# Altium schematic sheet KIP_2Schematic.SchDoc
size Tabloid; SheetNumber: 1; SheetTotal: 1
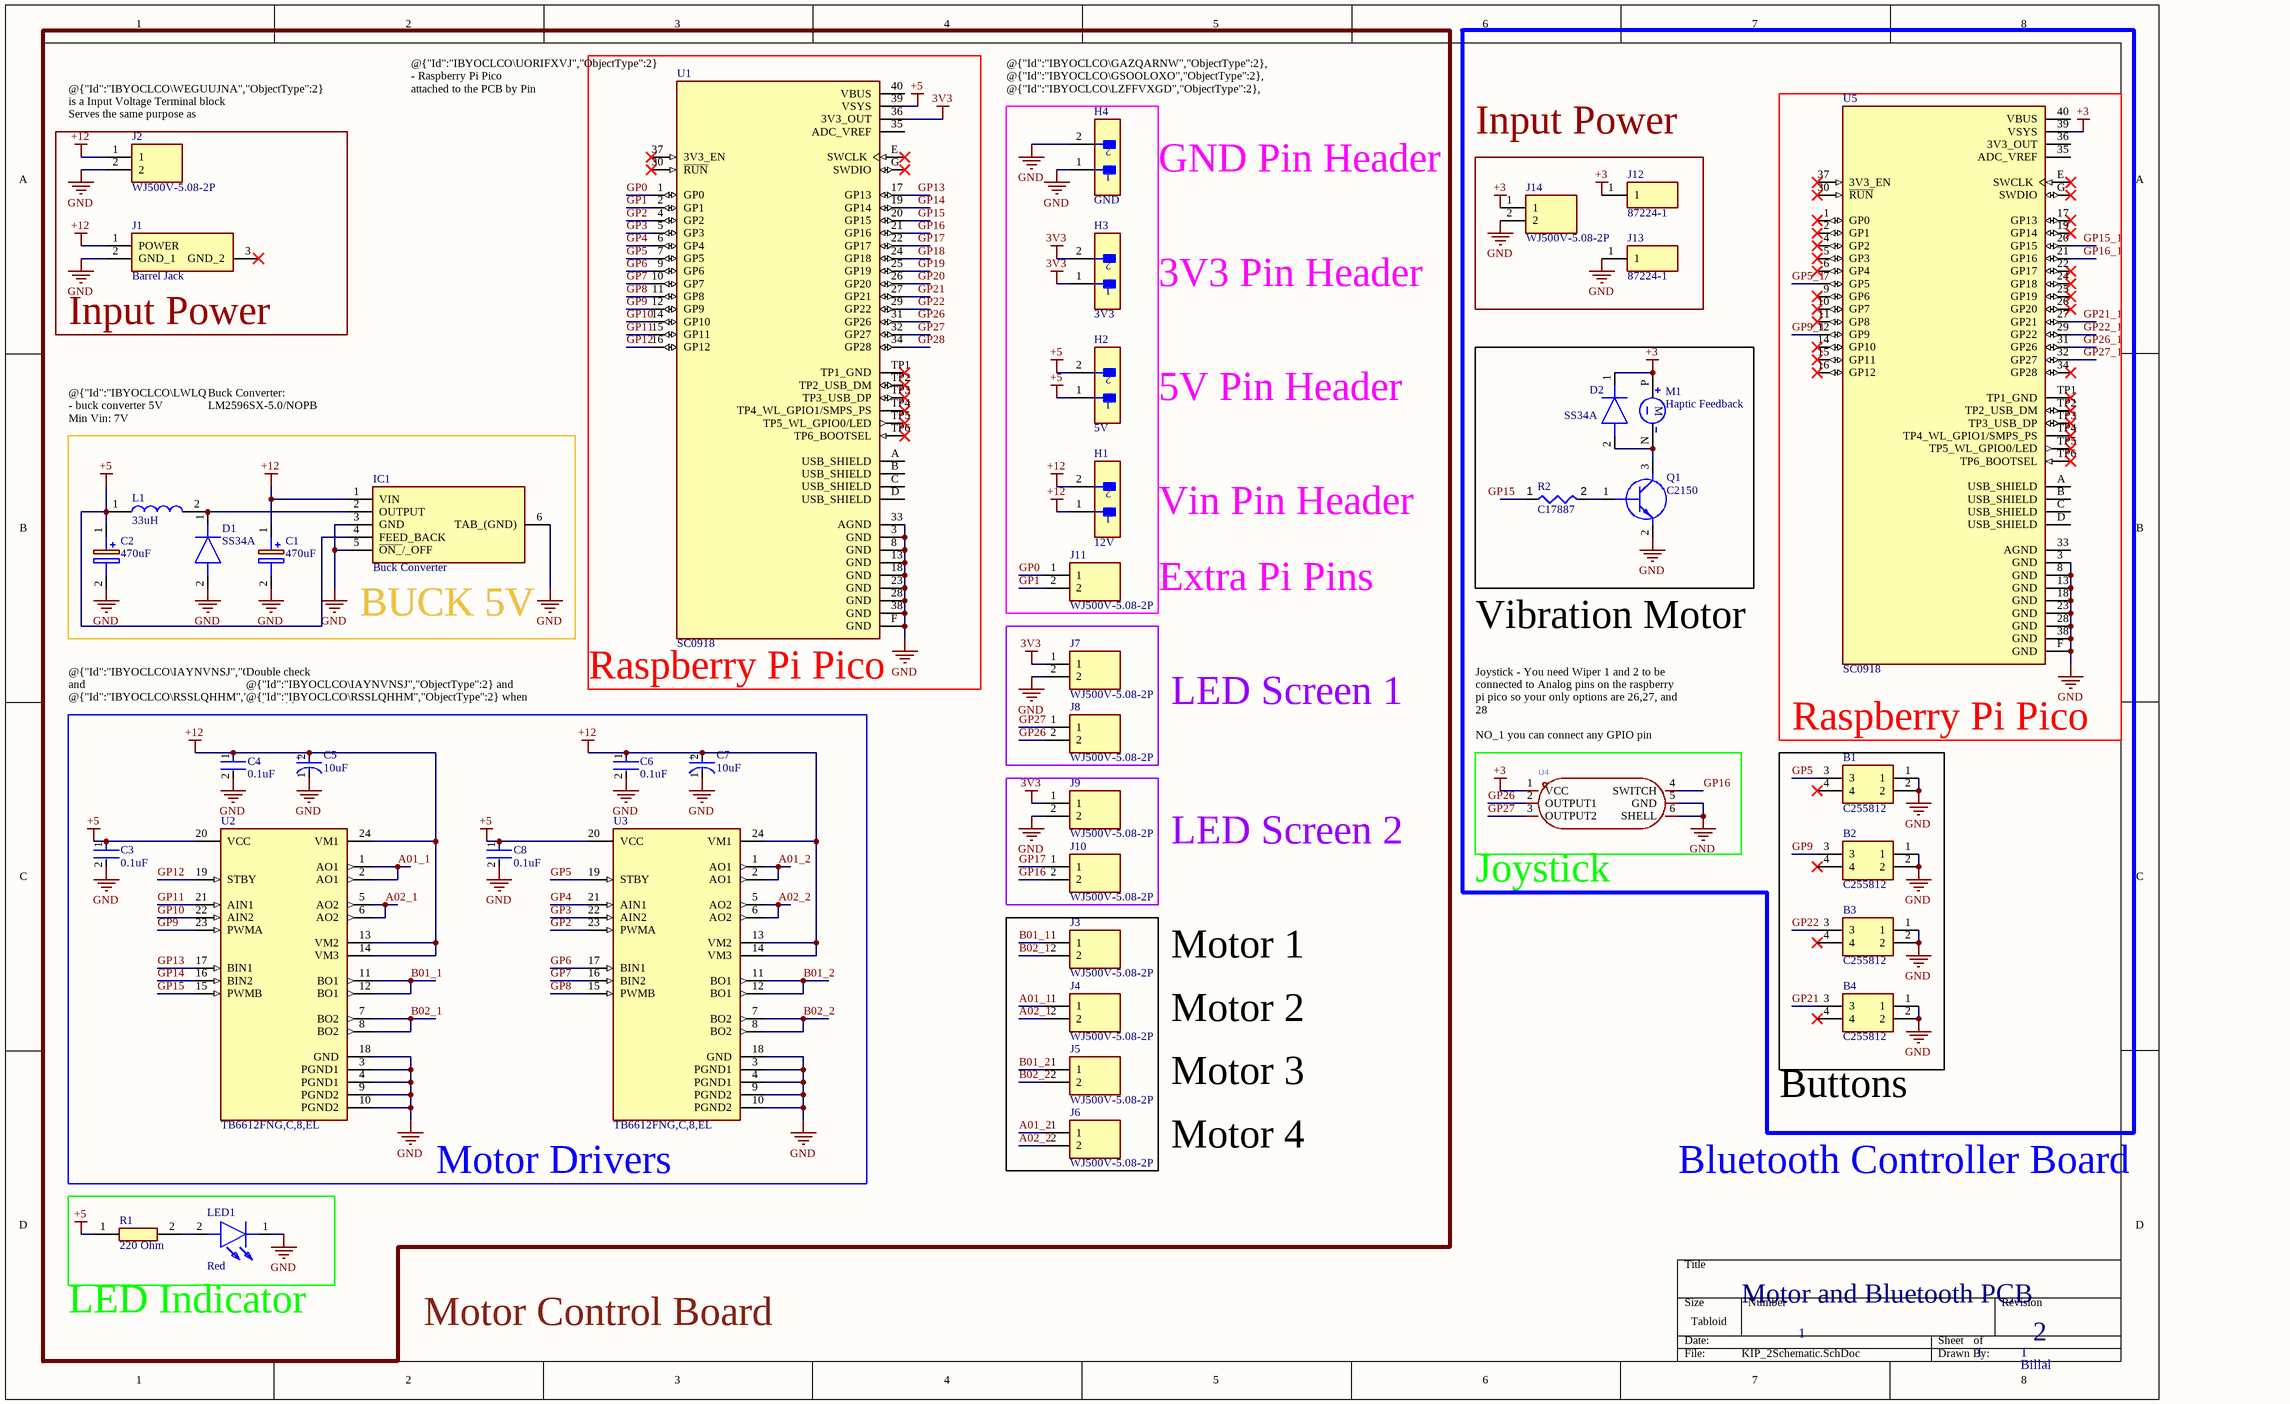
[diagram p0: KIP_2Schematic.SchDoc]

## Parts
B1  C255812  [Button]
B2  C255812  [Button]
B3  C255812  [Button]
B4  C255812  [Button]
C1  470uF  [CAPPRD350W65D800H2200]
C2  470uF  [CAPPRD350W65D800H2200]
C3  0.1uF  [FP-CL779-IPC_C]
C4  0.1uF  [FP-CL779-IPC_C]
C5  10uF  [FP-TAJA-MFG]
C6  0.1uF  [FP-CL779-IPC_C]
C7  10uF  [FP-TAJA-MFG]
C8  0.1uF  [FP-CL779-IPC_C]
D1  SS34A  [DIOM5026X262N]
D2  SS34A  [DIOM5026X262N]
H1  12V  [FP-M20-9990246-MFG]
H2  5V  [FP-M20-9990246-MFG]
H3  3V3  [FP-M20-9990246-MFG]
H4  GND  [FP-M20-9990246-MFG]
IC1  Buck Converter  [KTT0005B]
J1  Barrel Jack  [694106301002_1]
J2  WJ500V-5.08-2P  [WJ500V5082P]
J3  WJ500V-5.08-2P  [WJ500V5082P]
J4  WJ500V-5.08-2P  [WJ500V5082P]
J5  WJ500V-5.08-2P  [WJ500V5082P]
J6  WJ500V-5.08-2P  [WJ500V5082P]
J7  WJ500V-5.08-2P  [WJ500V5082P]
J8  WJ500V-5.08-2P  [WJ500V5082P]
J9  WJ500V-5.08-2P  [WJ500V5082P]
J10  WJ500V-5.08-2P  [WJ500V5082P]
J11  WJ500V-5.08-2P  [WJ500V5082P]
J12  87224-1  [HDRV1W66P0X254_1X1_213X254X1074P]
J13  87224-1  [HDRV1W66P0X254_1X1_213X254X1074P]
J14  WJ500V-5.08-2P  [WJ500V5082P]
L1  33uH  [INDPM144128X650N]
LED1  Red  [LEDC1608X70N]
M1  Haptic Feedback  [Haptic Feedback]
Q1  C2150  [SOT95P240X115-3N]
R1  220 Ohm  [RESC2013X65N]
R2  C17887  [Resistor 300Ohms]
U1  SC0918  [No pin-header Pi]
U2  TB6612FNG,C,8,EL  [FP-SSOP24-P-300-0_65A-IPC_A]
U3  TB6612FNG,C,8,EL  [FP-SSOP24-P-300-0_65A-IPC_A]
U4  C42411044  [Correct Joystick]  (value not drawn)
U5  SC0918  [No pin-header Pi]

## Blocks framed on the sheet
Raspberry Pi Pico: U1
Input Power: J1 J2
Input Power: J12-J14
BUCK 5V: C1 C2 D1 IC1 L1
Motor Drivers: C3-C8 U2 U3
Raspberry Pi Pico: B1-B4

## Nets
3V3: H3.1 H3.2 J7.1 J9.1 U1.36(3V3_OUT)
+3: D2.1(K) J12.1 J14.1 M1.P(POS) U4.1(VCC) U5.39(VSYS)
+5: C2.1(+) C3.1 C8.1 H2.1 H2.2 IC1.4(FEED_BACK) L1.1 R1.1 U1.39(VSYS) U2.20(VCC) U3.20(VCC)
+12: C1.1(+) C4.1 C5.2(A) C6.1 C7.2(A) H1.1 H1.2 IC1.1(VIN) J1.1(POWER) J2.1 U2.13(VM2) U2.14(VM3) U2.24(VM1) U3.13(VM2) U3.14(VM3) U3.24(VM1)
GND: B1.1 B1.2 B2.1 B2.2 B3.1 B3.2 B4.1 B4.2 C1.2(-) C2.2(-) C3.2 C4.2 C5.1(C) C6.2 C7.1(C) C8.2 D1.2(A) H4.1 H4.2 IC1.3(GND) IC1.5(~{ON_}/_OFF) IC1.6(TAB_(GND)) J1.2(GND_1) J2.2 J7.2 J9.2 J13.1 J14.2 LED1.1(K) Q1.2(E) U1.3(GND) U1.8(GND) U1.13(GND) U1.18(GND) U1.23(GND) U1.28(GND) U1.33(AGND) U1.38(GND) U1.F(GND) U2.3(PGND1) U2.4(PGND1) U2.9(PGND2) U2.10(PGND2) U2.18(GND) U3.3(PGND1) U3.4(PGND1) U3.9(PGND2) U3.10(PGND2) U3.18(GND) U4.5(GND) U4.6(SHELL) U5.3(GND) U5.8(GND) U5.13(GND) U5.18(GND) U5.23(GND) U5.28(GND) U5.38(GND) U5.F(GND)
A01_1: J4.1 U2.1(AO1) U2.2(AO1)
A01_2: J6.1 U3.1(AO1) U3.2(AO1)
A02_1: J4.2 U2.5(AO2) U2.6(AO2)
A02_2: J6.2 U3.5(AO2) U3.6(AO2)
B01_1: J3.1 U2.11(BO1) U2.12(BO1)
B01_2: J5.1 U3.11(BO1) U3.12(BO1)
B02_1: J3.2 U2.7(BO2) U2.8(BO2)
B02_2: J5.2 U3.7(BO2) U3.8(BO2)
GP0: J11.1 U1.1(GP0)
GP1: J11.2 U1.2(GP1)
GP2: U1.4(GP2) U3.23(PWMA)
GP3: U1.5(GP3) U3.22(AIN2)
GP4: U1.6(GP4) U3.21(AIN1)
GP5: B1.3 U1.7(GP5) U3.19(STBY)
GP5_1: U5.7(GP5)
GP6: U1.9(GP6) U3.17(BIN1)
GP7: U1.10(GP7) U3.16(BIN2)
GP8: U1.11(GP8) U3.15(PWMB)
GP9: B2.3 U1.12(GP9) U2.23(PWMA)
GP9_1: U5.12(GP9)
GP10: U1.14(GP10) U2.22(AIN2)
GP11: U1.15(GP11) U2.21(AIN1)
GP12: U1.16(GP12) U2.19(STBY)
GP13: U1.17(GP13) U2.17(BIN1)
GP14: U1.19(GP14) U2.16(BIN2)
GP15: U1.20(GP15) U2.15(PWMB)
GP15_1: U5.20(GP15)
GP16: J10.2 U1.21(GP16) U4.4(SWITCH)
GP16_1: U5.21(GP16)
GP17: J10.1 U1.22(GP17)
GP18: U1.24(GP18)
GP19: U1.25(GP19)
GP20: U1.26(GP20)
GP21: B4.3 U1.27(GP21)
GP21_1: U5.27(GP21)
GP22: B3.3 U1.29(GP22)
GP22_1: U5.29(GP22)
GP26: J8.2 U1.31(GP26) U4.2(OUTPUT1)
GP26_1: U5.31(GP26)
GP27: J8.1 U1.32(GP27) U4.3(OUTPUT2)
GP27_1: U5.32(GP27)
GP28: U1.34(GP28)
NetD1_1: D1.1(K) IC1.2(OUTPUT) L1.2
NetD2_2: D2.2(A) M1.N(NEG) Q1.3(C)
NetLED1_2: LED1.2(A) R1.2
NetQ1_1: Q1.1(B) R2.2

Not connected (* = marked no-connect by the designer): B1 4*; B2 4*; B3 4*; B4 4*; J1 3(GND_2)*; R2 1; U1 30(~{RUN})* 35(ADC_VREF) 37(3V3_EN)* 40(VBUS) A(USB_SHIELD) B(USB_SHIELD) C(USB_SHIELD) D(USB_SHIELD) E(SWCLK)* G(SWDIO)* TP1(TP1_GND)* TP2(TP2_USB_DM)* TP3(TP3_USB_DP)* TP4(TP4_WL_GPIO1/SMPS_PS)* TP5(TP5_WL_GPIO0/LED)* TP6(TP6_BOOTSEL)*; U5 1(GP0)* 2(GP1)* 4(GP2)* 5(GP3)* 6(GP4)* 9(GP6)* 10(GP7)* 11(GP8)* 14(GP10)* 15(GP11)* 16(GP12)* 17(GP13)* 19(GP14)* 22(GP17)* 24(GP18)* 25(GP19)* 26(GP20)* 30(~{RUN})* 33(AGND) 34(GP28)* 35(ADC_VREF) 36(3V3_OUT) 37(3V3_EN)* 40(VBUS) A(USB_SHIELD) B(USB_SHIELD) C(USB_SHIELD) D(USB_SHIELD) E(SWCLK)* G(SWDIO)* TP1(TP1_GND)* TP2(TP2_USB_DM)* TP3(TP3_USB_DP)* TP4(TP4_WL_GPIO1/SMPS_PS)* TP5(TP5_WL_GPIO0/LED)* TP6(TP6_BOOTSEL)*

## Notes on the sheet
- @{"Id":"IBYOCLCO\UORIFXVJ","ObjectType":2} - Raspberry Pi Pico
  attached to the PCB by Pin Headers
- @{"Id":"IBYOCLCO\GAZQARNW","ObjectType":2}, @{"Id":"IBYOCLCO\GSOOLOXO","ObjectType":2}, @{"Id":"IBYOCLCO\LZFFVXGD","ObjectType":2}, @{"Id":"IBYOCLCO\AGFTMCIK","ObjectType":2}, and @{"Id":"IBYOCLCO\RTYWPQXP","ObjectType":2} are all unnecessary
- (near J2) @{"Id":"IBYOCLCO\WEGUUJNA","ObjectType":2} is a Input Voltage Terminal block
  Serves the same purpose as @{"Id":"IBYOCLCO\JABENFYY","ObjectType":2}
- GND Pin Header
- 3V3 Pin Header
- 5V Pin Header
- @{"Id":"IBYOCLCO\LWLQUORI","ObjectType":2} - buck converter 5V
  Min Vin: 7V
  Max Vin: 15V
- Buck Converter: LM2596SX-5.0/NOPB
- Vin Pin Header
- Extra Pi Pins
- Vibration Motor
- @{"Id":"IBYOCLCO\IAYNVNSJ","ObjectType":2} and @{"Id":"IBYOCLCO\RSSLQHHM","ObjectType":2} are both copies of the same motor driver - TB6612FNG(O,C,8,EL
- Double check @{"Id":"IBYOCLCO\IAYNVNSJ","ObjectType":2} and @{"Id":"IBYOCLCO\RSSLQHHM","ObjectType":2} when placing a Assembly order on JLCPCB for some reason it rotates them by 270 degrees and check @{"Id":"IBYOCLCO\ZWIIDHKI","ObjectType":2} and @{"Id":"IBYOCLCO\QKLSIOWQ","ObjectType":2} JLCPCB rotates it by 180 degrees
- LED Screen 1
- (near U4) Joystick - You need Wiper 1 and 2 to be connected to Analog pins on the raspberry pi pico so your only options are 26,27, and 28
  NO_1 you can connect any GPIO pin
- LED Screen 2
- (near U4) Joystick
- Motor 1
- Motor 2
- Motor 3
- (near B4) Buttons
- Motor 4
- Bluetooth Controller Board
- LED Indicator
- Motor Control Board
- Motor and Bluetooth PCB
- 1
- 2
- Billal
- Labels drawn without touching a wire or pin: GP15
- (in symbol CMP-1661-00004-2) +
- (in symbol Haptic Feedback) M

## Library data of the parts
B1-B4 = 1TS005F-2500-5001: Switch; Manufacturer_Name: HYP (Hongyuan Precision); Datasheet Link: https://datasheet.lcsc.com/szlcsc/HYP-1TS005F-2500-5001_C255812.pdf; Height: 5.1mm; Manufacturer_Part_Number: 1TS005F-2500-5001
C1 C2 = EEU-FR1V471LB: C178717; Manufacturer_Name: Panasonic; Datasheet Link: http://industrial.panasonic.com/cdbs/www-data/pdf/RDF0000/ABA0000C1259.pdf; Height: 22mm; Manufacturer_Part_Number: EEU-FR1V471LB; Mouser Part Number: 667-EEU-FR1V471LB; Mouser Price/Stock: https://www.mouser.co.uk/ProductDetail/Panasonic/EEU-FR1V471LB?qs=n1SRcuzDZT29cYaqooxsEQ%3D%3D; Arrow Part Number: EEU-FR1V471LB; Arrow Price/Stock: https://www.arrow.com/en/products/eeu-fr1v471lb/panasonic?region=nac
C3 C4 C6 C8 = CMP-13271-002336-1: C307331; LCSC: C307331
C5 C7 = CMP-1661-00004-2: C7171; Voltage Rating: 16V; ESR (Equivalent Series Resistance): 3R; Leakage Current: 1.6uA; Dissipation Factor: 8%; Dielectric Material: Tantalum; Polarity: Polar; Tolerance: 10%; Length: 3.2mm; Features: General Purpose; Voltage: 16V; Mount: Surface Mount; Case/Package: 1206; Number of Pins: 2; Case Code (Metric): 3216; Radiation Hardening: No; Min Operating Temperature: -55°C; Case Code (Imperial): 1206; Height - Seated (Max): 0.071inch; Lead Free: Lead Free; Termination: SMD/SMT; Width: 1.6mm; Capacitance: 10uF; Lead Pitch: 1.1mm; Max Operating Temperature: 125°C; Voltage Rating (DC): 16V; Packaging: Tape and Reel; Package Quantity: 1; REACH SVHC: No SVHC; Depth: 1.6mm; Height: 1.6mm; LCSC: C7171
D1 D2 = SS34A: Diode; Manufacturer_Name: HY Electronic; Datasheet Link: https://datasheet.datasheetarchive.com/originals/distributors/Datasheets-3/DSA-43252.pdf; Height: 2.62mm; Manufacturer_Part_Number: SS34A
H1-H4 = CMP-15831-000009-1: C492401; Manufacturer: Harwin; Manufacturer Part Number: M20-9990246; Conn Gender: Male; Conn Orientation: Vertical; Pitch: 2.54mm; Number Of Contacts: 2; Current Rating: 3A; ComponentLink2URL: https://cdn.harwin.com/pdfs/M20-999.pdf; ComponentLink2Description: Datasheet; Package: M20-9990246; Temperature: -40°C to +105°C; Octopart: https://octopart.com/m20-9990246-harwin-2590635; Mouser Description: 2.54mm (0.1") Pitch SIL Vertical PC Tail Pin Header, 6.1mm mating pin height, tin, 2 contacts; Temperature Range High: +105°C; Device Class L1: Connectors; RoHS: TRUE; Automotive: No; Height: 8.99mm; Number Of Rows: 1; Contact Material: Tin,Nickel; Category: Conn; Lead Free: Yes; Digikey Description: CONN HEADER VERT 2POS 2.54MM; Temperature Range Low: -40°C; Device Class L3: unset; Device Class L2: Headers and Wire Housings
IC1 = LM2596SX-5.0_NOPB: C10002; Manufacturer_Name: Texas Instruments; Manufacturer_Part_Number: LM2596SX-5.0/NOPB; Datasheet Link: http://www.ti.com/lit/gpn/lm2596; Mouser Part Number: 926-LM2596SX-5.0NOPB; Mouser Price/Stock: https://www.mouser.co.uk/ProductDetail/Texas-Instruments/LM2596SX-5.0-NOPB?qs=X1J7HmVL2ZGZ5T4VcWdmNw%3D%3D; Arrow Part Number: LM2596SX-5.0/NOPB; Arrow Price/Stock: https://www.arrow.com/en/products/lm2596sx-5.0nopb/texas-instruments?utm_currency=USD&region=nac; LCSC: C10002
J1 = 694106301002: C5441017; Manufacturer_Name: Wurth Elektronik; Datasheet Link: https://datasheet.datasheetarchive.com/originals/distributors/Datasheets_SAMA/1c153bd2ba42bb51bda59ee4cd9765cd.pdf; Manufacturer_Part_Number: 694106301002; Mouser Part Number: 710-694106301002; Mouser Price/Stock: https://www.mouser.co.uk/ProductDetail/Wurth-Elektronik/694106301002?qs=a9WhcLg8qCwOEkcI62k5mA%3D%3D; LCSC: C5441017
J2-J11 J14 = WJ500V-5.08-2P: C8465; Manufacturer_Name: Ningbo Kangnex; Datasheet Link: https://datasheet.lcsc.com/szlcsc/1912251636_Ningbo-Kangnex-Elec-WJ500V-5-08-2P_C8465.pdf; Height: 14.2mm; Manufacturer_Part_Number: WJ500V-5.08-2P; LCSC: C8465
J12 J13 = 87224-1: Connector; Manufacturer_Name: TE Connectivity; Datasheet Link: https://www.te.com/commerce/DocumentDelivery/DDEController?Action=srchrtrv&DocNm=87224&DocType=Customer+Drawing&DocLang=English; Height: 10.744mm; Manufacturer_Part_Number: 87224-1; Mouser Part Number: 571-872241; Mouser Price/Stock: https://www.mouser.co.uk/ProductDetail/TE-Connectivity/87224-1?qs=uJX40y%252BSWqgHHhtbHlovpg%3D%3D; Arrow Part Number: 87224-1; Arrow Price/Stock: https://www.arrow.com/en/products/87224-1/te-connectivity?region=nac
L1 = SLO1365H330MTT: C364090; Manufacturer_Name: Sunltech Tech; Datasheet Link: https://datasheet.lcsc.com/lcsc/1912111437_Sunltech-Tech-SLO1365H330MTT_C364090.pdf; Height: 6.5mm; Manufacturer_Part_Number: SLO1365H330MTT
LED1 = KT-0603R: C2286; Manufacturer_Name: Hubei KENTO Elec; Datasheet Link: https://datasheet.lcsc.com/szlcsc/Hubei-KENTO-Elec-KT-0603R_C2286.pdf; Height: 0.7mm; Manufacturer_Part_Number: KT-0603R; LCSC: C2286
Q1 = SS8050-G: Manufacturer_Name: Comchip Technology; Datasheet Link: https://datasheet.datasheetarchive.com/originals/distributors/DKDS-12/229454.pdf; Height: 1.15mm; Manufacturer_Part_Number: SS8050-G; Mouser Part Number: 750-SS8050-G; Mouser Price/Stock: https://www.mouser.co.uk/ProductDetail/Comchip-Technology/SS8050-G?qs=LLUE9lz1YbcHg%252BWLMAtcrQ%3D%3D; Arrow Part Number: SS8050-G; Arrow Price/Stock: https://www.arrow.com/en/products/ss8050-g/comchip-technology?region=nac
R1 = 0805W8F2200T5E: C17557; Manufacturer_Name: ROYALOHM; Datasheet Link: https://datasheet.lcsc.com/lcsc/2206010200_UNI-ROYAL-Uniroyal-Elec-0805W8F4700T5E_C17710.pdf; Height: 0.65mm; Manufacturer_Part_Number: 0805W8F2200T5E; Mouser Part Number: 303-0805W8F2200T5E; Mouser Price/Stock: https://www.mouser.co.uk/ProductDetail/Royalohm/0805W8F2200T5E?qs=e8oIoAS2J1ROMjq8h%252B%2Fhvg%3D%3D; LCSC: C17557
R2 = Resistor 300Ohms
U1 U5 = CMP-009-000001-1: Raspberry Pi Pico W RP2040; Manufacturer: Raspberry Pi; Design Item ID: SC0918; Manufacturer Part Number: SC0918; Source: Schlib1.SchLib; RoHS: No; Pricing: 1=6 (USD); Stock: 4318
U2 U3 = CMP-2100-03693-4: C88224; Logic Function: AND GATE; Interface: Parallel; Operating Supply Voltage: 3V; Max Supply Voltage: 5.5V; Output Current: 1A; Min Supply Voltage: 2.7V; Number of Outputs: 2; Packaging: Tape and Reel; Mount: Surface Mount; Number of Pins: 24; Min Operating Temperature: -20°C; Case/Package: SSOP; Series: -; Max Operating Temperature: 85°C; Package Quantity: 1; LCSC: *
U4 = YHE-YG16-001 SH1B166A1: Manufacturer: YTL(亚特联); Add into BOM: yes; Symbol: YHE-YG16-001 SH1B166A1; Device: YHE-YG16-001 SH1B166A1; LCSC Part Name: YHE-YG16-001 SH1B166A1; Supplier Part: C42411044; Manufacturer Part: YHE-YG16-001 SH1B166A1; Supplier Footprint: 插件; Datasheet: https://atta.szlcsc.com/upload/public/pdf/source/20241210/EC2F2FFC22DA7A673EF560687C693A55.pdf; Supplier: LCSC; Convert to PCB: yes